# EAGLE design Own_Sensor.Measuring.Bridge.dev_v1.0_Final_AR (EAGLE 9.6.2)
COMPANY: ADAFRUIT INDUSTRIES; DRAWN: KTOWN; REV: A; YEAR: 2019
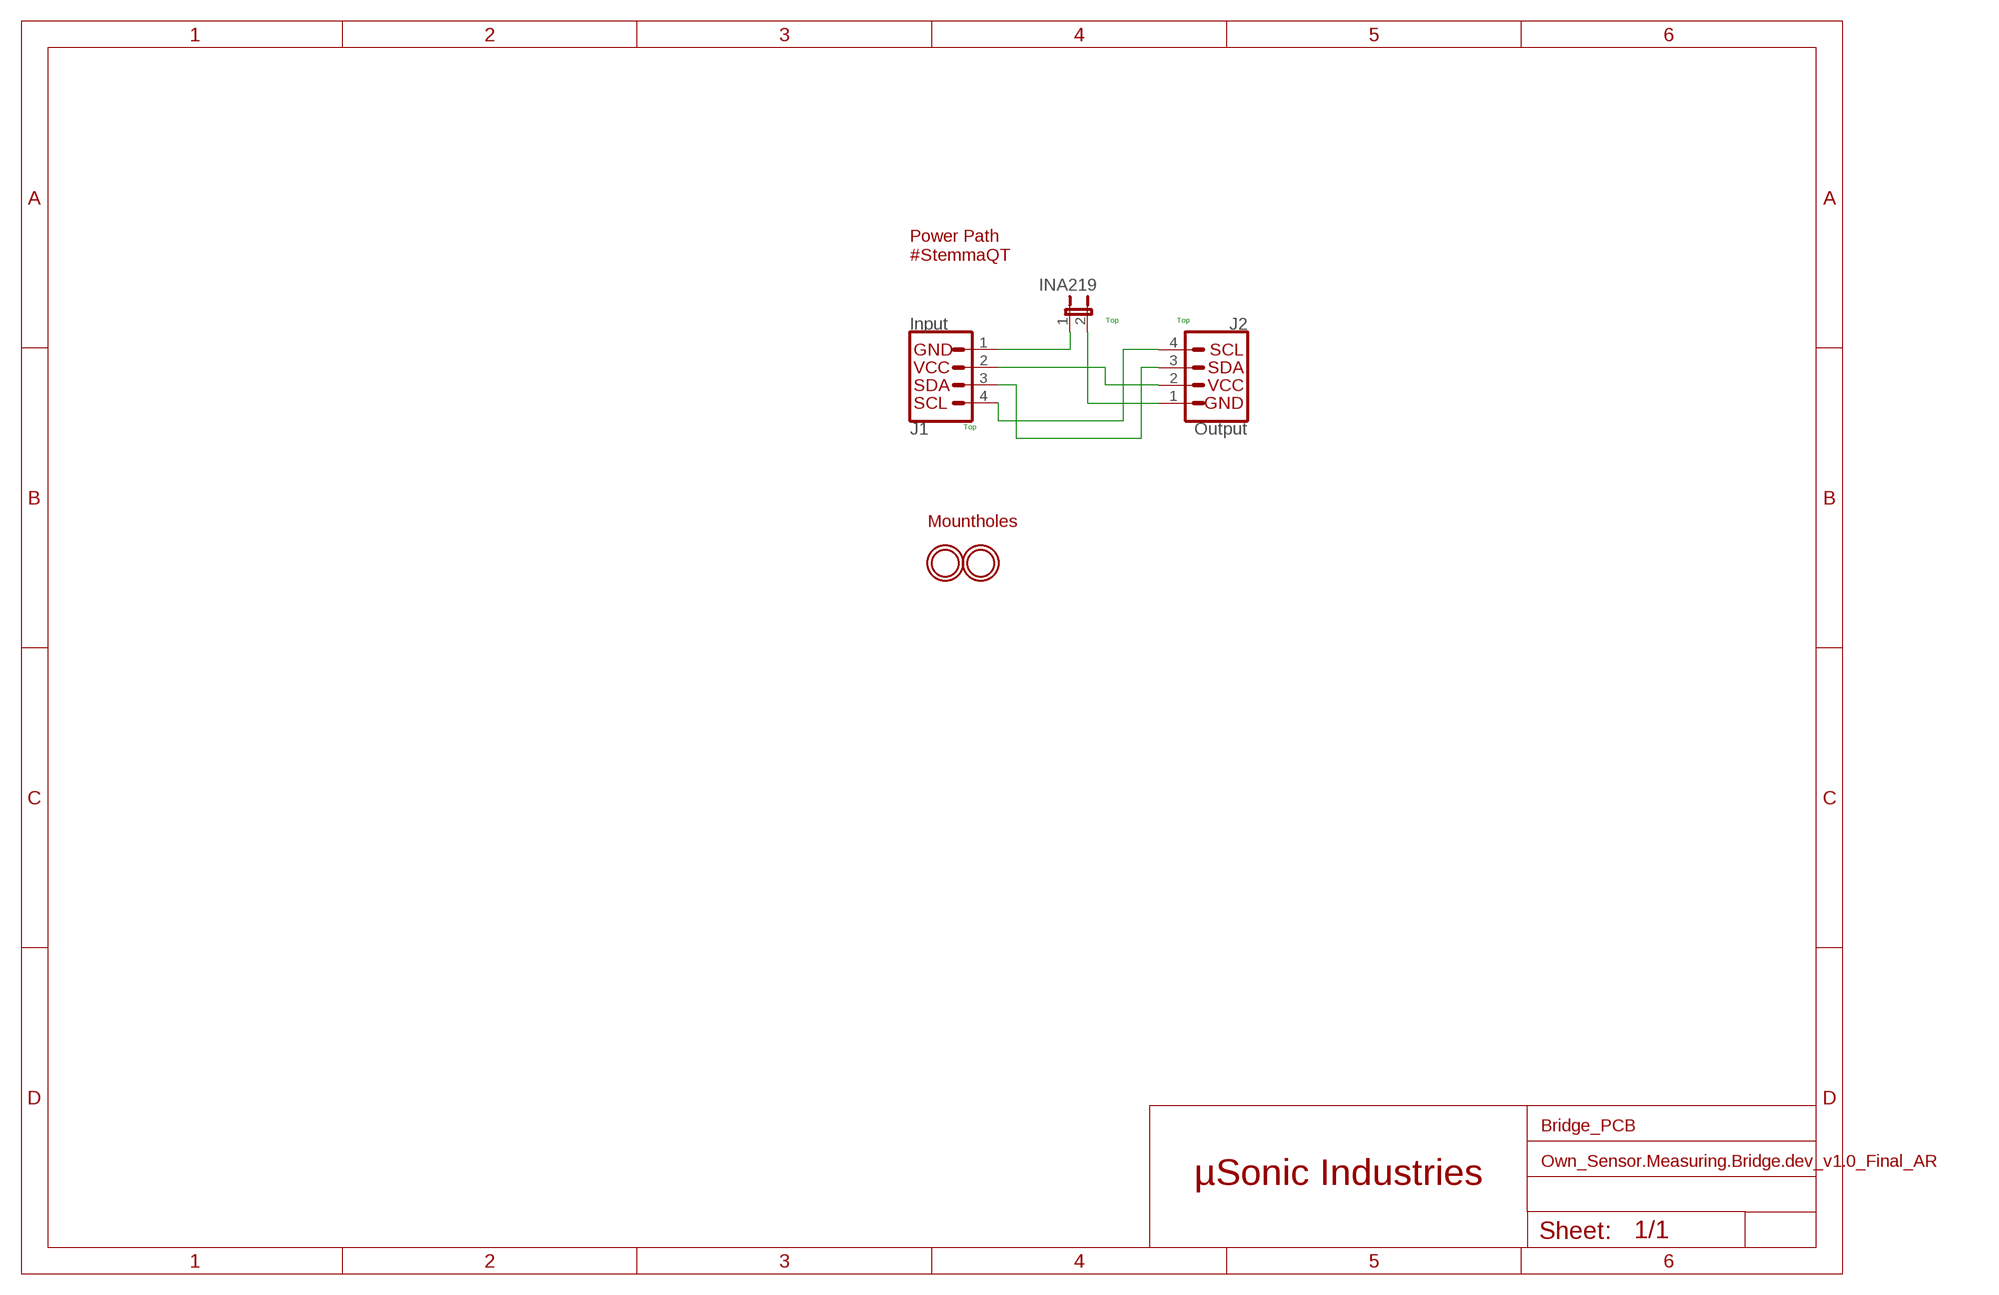
[diagram p0: schematic, sheet 1]

## Parts
INA219  JP1E  [JP1]
J1  Input  I2C_STANDARDQWIIC  [JST04_1MM_RA]
J2  Output  I2C_STANDARDQWIIC  [JST04_1MM_RA]
U$18  MOUNTINGHOLE2.5  [MOUNTINGHOLE_2.5_PLATED]
U$19  MOUNTINGHOLE2.5  [MOUNTINGHOLE_2.5_PLATED]

## Nets
3V3: J1.2 J2.2
GND1: INA219.1 J1.1
GND2: INA219.2 J2.1
SCL: J1.4 J2.4
SDA: J1.3 J2.3

## Notes on the sheet
- Power Path
  #StemmaQT
- Top | Top
- Top
- Mountholes
- Bridge_PCB
- µSonic Industries

## Library data of the parts
INA219 = jumper:JP1E: JUMPER
J1 J2 = SparkFun-Connectors2:I2C_STANDARD: SparkFun I2C Standard Pinout Header SparkFun has standardized on a pinout for all I2C based sensor breakouts. This pinout allows I2C boards to be plugged directly into the headers on Arduino Uno compatible boards, and to be daisy chained easily. Example SparkFun Products: SparkFun Atmospheric Sensor Breakout - BME280 <https://www.sparkfun.com/products/13676> SparkFun Altitude/Pressure Sensor Breakout - MPL3115A2 <https://www.sparkfun.com/products/11084> SparkFun TOF Range Finder Sensor - VL6180 <https://www.sparkfun.com/products/12785>; PROD_ID: CONN-13694; VALUE: Qwiic Right Angle
U$18 U$19 = microbuilder:MOUNTINGHOLE: Mounting Hole For #2 screws (0.086"/2.18mm width, 0.094"/2.4mm hole) use 2.5mm; BOM: EXCLUDE

## Net classes
0 default: width 0.175 mm

## Board
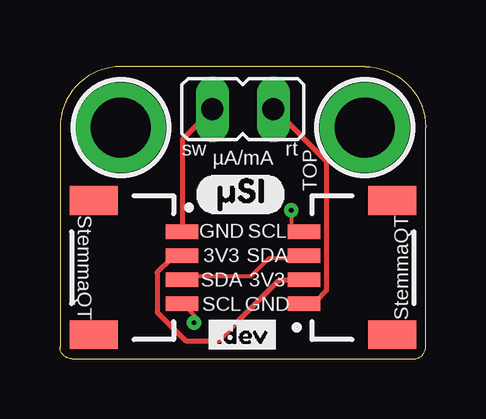
[diagram p1: board, top side]
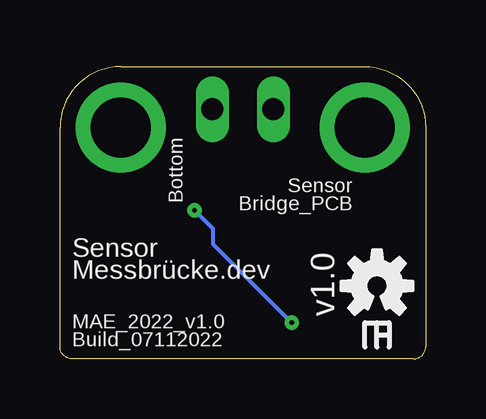
[diagram p2: board, bottom side, seen from below]

Size 15.24 x 12.19 mm. Coordinates in mm from the lower left corner, seen from the top.
Outline: 0,9.65 0,0.51 arc90 0.51,0 14.73,0 arc90 15.24,0.51 15.24,9.65 arc90 12.7,12.19 2.54,12.19 arc90 0,9.65
Copper layers (1*16): Top 0.035mm / dielectric 1.5mm / Bottom 0.035mm
Design rules "aisler_2_layer_complex": minimum track width 0.125mm, minimum drill 0.2mm, track to track 0.125mm, track to pad 0.125mm, pad to pad 0.125mm, via to via 0.125mm, smd to smd 0.125mm, copper to edge 0.3mm, drill to drill 0.25mm, minimum pad ring 0.2mm, minimum via ring 0.2mm, stop-mask expansion 0mil, vias tented up to drill 0mil, thermal gap 10mil

### Footprints (pad centres in the part's own frame; a part is rotated, then mirrored left to right if it is on the bottom)
JP1 = drill 0.914 long: 1 0,-1.27; 2 0,1.27
JST04_1MM_RA = smd 0.6 x 1.35: 1 -1.5,0; 2 -0.5,0; 3 0.5,0; 4 1.5,0 | smd 1.2 x 2: NC1 2.8,-3.675; NC2 -2.8,-3.675
MOUNTINGHOLE_2.5_PLATED = drill 2.5 pad 3.2: P$1 0,0

### Placement (x,y rotation side)
INA219  7.62,10.41 270 top
J1  5.08,3.81 270 top
J2  10.16,3.81 90 top
U$2  [#DEV0]  5.84,1.02 0 top
U$4  [OSHW-LOGO-S]  2.03,3.05 0 bottom
U$5  [#SI0]  5.59,6.86 0 top
U$18  12.7,9.65 0 top
U$19  2.54,9.65 0 top

### Tracks (layer width: path | path; a pad name or v marks a point on that pad's centre or on a via)
3V3
  Top 0.2: J2.2 10.05,3.3 9.14,3.3 6.6,0.76 5.24,0.76 4.05,1.95 4.05,3.6 4.65,4.2 4.95,4.2 J1.2
GND1
  Top 0.2: J1.1 5.1,5.4 5.1,9.15 6.3,10.35 INA219.1
GND2
  Top 0.2: J2.1 10.2,2.4 10.65,2.4 11.1,2.85 11.1,8.25 9,10.35 INA219.2
SCL  (via drill 0.2)
  Top 0.175: J1.4 5.58,1.81 v5.58,1.51 | v9.63,6.2 9.63,5.25 10.05,5.25 J2.4
  Bottom 0.175: v9.63,6.2 8.87,5.43 8.87,4.8 v5.58,1.51
SDA
  Top 0.175: J1.3 5.1,3.45 7.95,3.45 8.7,4.2 10.05,4.2 J2.3

### Text on the board
tPlace: sw | rt | µA/mA | TOP | GND | SCL | StemmaQT | 3V3 | SDA | StemmaQT | SDA | 3V3 | SCL | GND
bPlace: Bottom | Sensor / Bridge_PCB | Sensor / Messbrücke.dev | v1.0 | MAE_2022_v1.0 / Build_07112022